# EAGLE design Chime PCB v2.8_11.17 (EAGLE 9.6.2)
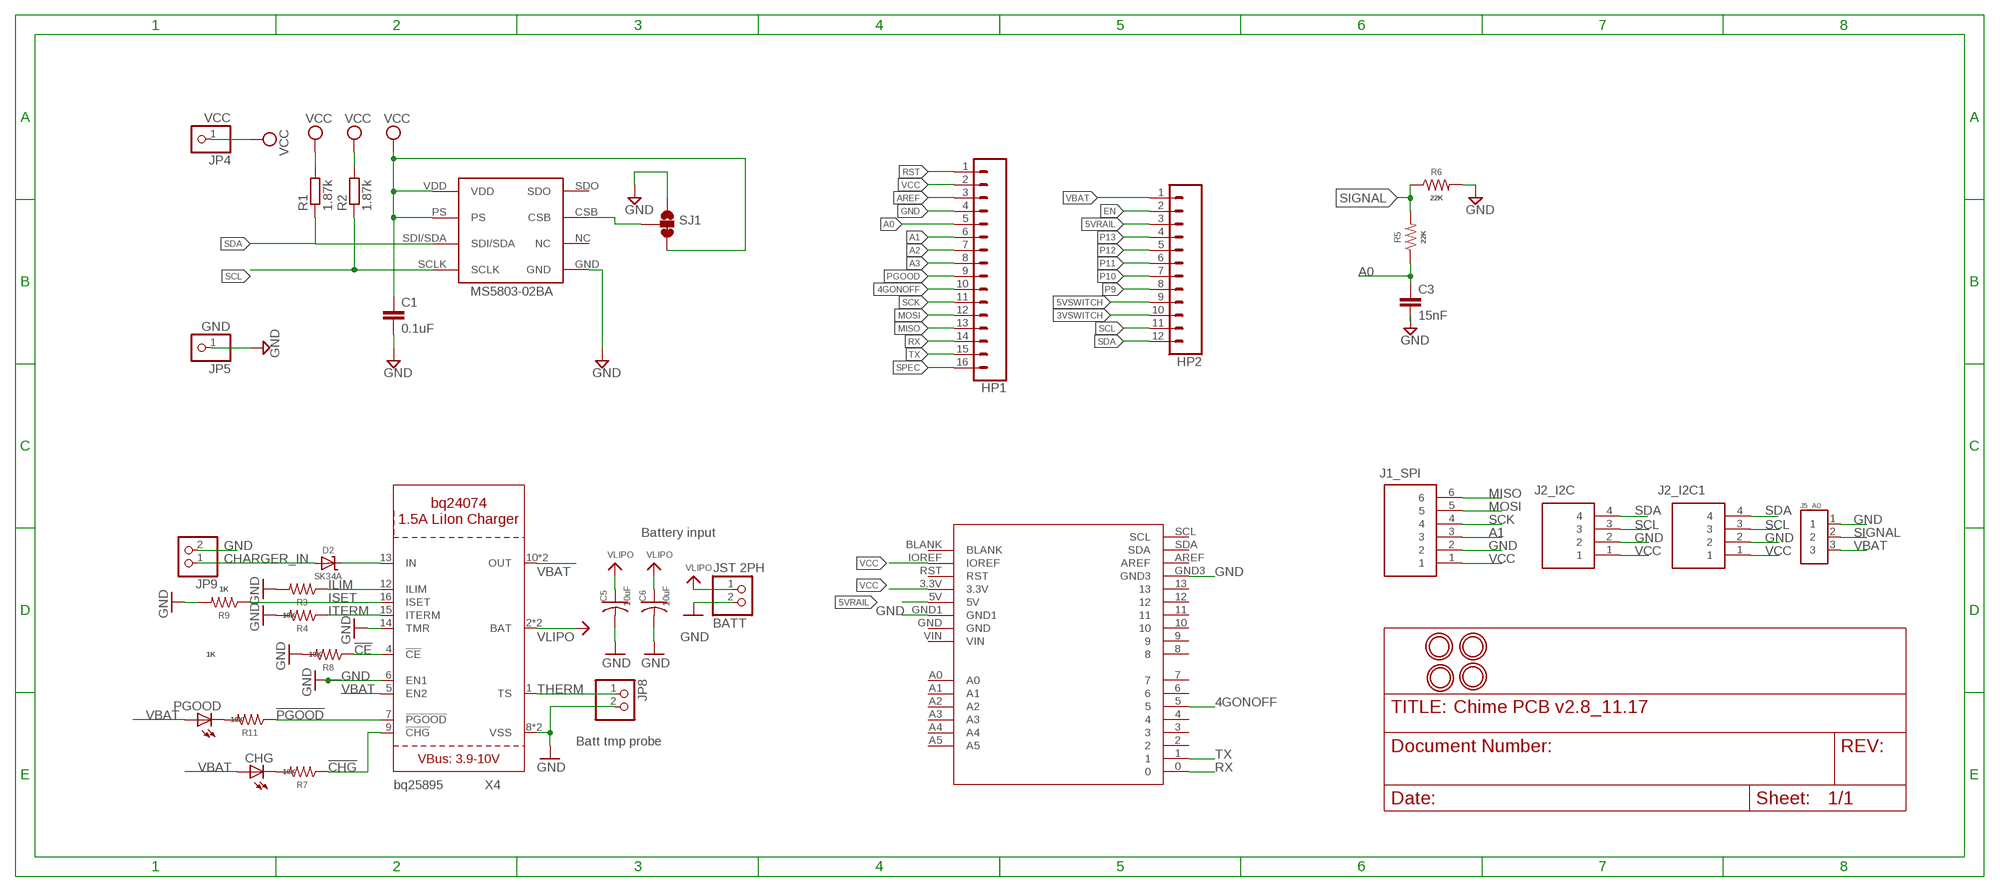
[diagram p0: schematic, sheet 1]

## Parts
BATT  JST 2PH  JST_2PIN-SMT-RA  [JST-PH-2-SMT-RA]
C1  0.1uF  C-EUC0805  [C0805]
C3  15nF  C-EUC0805  [C0805]
C5  10uF  C-USC0805K  [C0805K]
C6  10uF  C-USC0805K  [C0805K]
CHG  LEDCHIPLED_0805  [CHIPLED_0805]
D2  SK34A  DIODE-SCHOTTKYSMA  [SMADIODE]
HP1  CONN_16  [1X16]
HP2  CONN_12  [1X12]
J1_SPI  1725698  [1725698]
J2_I2C  1725672  [1725672]
J2_I2C1  1725672  [1725672]
J5_A0  282834-3  [TE_282834-3]
JP4  VCC  PINHD-1X1  [1X01]
JP5  GND  PINHD-1X1  [1X01]
JP8  PINHD-1X2  [1X02]
JP9  PINHD-1X2  [1X02]
PGOOD  PGOOD  LEDCHIPLED_0805  [CHIPLED_0805]
R1  1.87k  R-EU_R0805  [R0805]
R2  1.87k  R-EU_R0805  [R0805]
R3  1K  R-US_M0805  [M0805]
R4  10K  R-US_M0805  [M0805]
R5  22K  R-US_M0805  [M0805]
R6  22K  R-US_M0805  [M0805]
R7  10K  R-US_M0805  [M0805]
R8  10K  R-US_M0805  [M0805]
R9  1K  R-US_M0805  [M0805]
R11  10K  R-US_M0805  [M0805]
SJ1  JUMPER-SMT_3_1-NC_TRACE_SILK  [SMT-JUMPER_3_1-NC_TRACE_SILK]
U1  MS5803-02BA  [MS5803-02BA]
U$1  LTE_BOARD  [LTE_BOARD_FOOTPRINT]
U$2  MOUNTINGHOLE2.5  [MOUNTINGHOLE_2.5_PLATED]
U$3  MOUNTINGHOLE2.5  [MOUNTINGHOLE_2.5_PLATED]
U$4  MOUNTINGHOLE2.5  [MOUNTINGHOLE_2.5_PLATED]
U$5  MOUNTINGHOLE2.5  [MOUNTINGHOLE_2.5_PLATED]
X4  BQ24074  [QFN16_3MM]

## Nets
3VSWITCH: HP2.10
4GONOFF: HP1.10 U$1.5
5VRAIL: HP2.3 U$1.5V
5VSWITCH: HP2.9
!CE: R8.1 X4.4(!CE)
!CHG: R7.1 X4.9(!CHG)
!PGOOD: R11.1 X4.7(!PGOOD)
A0: C3.1 HP1.5 R5.1
A1: HP1.6 J1_SPI.3
A2: HP1.7
A3: HP1.8
AREF: HP1.3
CHARGER_IN: D2.A JP9.1
EN: HP2.2
GND: BATT.2 C1.2 C3.2 C5.2 C6.2 HP1.4 J1_SPI.2 J2_I2C1.2 J2_I2C.2 J5_A0.1 JP5.1 JP8.2 JP9.2 R3.2 R4.2 R6.2 R8.2 R9.2 SJ1.1 U1.GND U$1.GND1 U$1.GND3 X4.6(EN1) X4.8(VSS) X4.14(TMR) X4.THERMAL(VSS)
ILIM: R3.1 X4.12(ILIM)
ISET: R9.1 X4.16(ISET)
ITERM: R4.1 X4.15(ITERM)
MISO: HP1.13 J1_SPI.6
MOSI: HP1.12 J1_SPI.5
N$2: D2.C X4.13(IN)
N$3: SJ1.2 U1.CSB
N$4: PGOOD.C R11.2
N$5: CHG.C R7.2
P9: HP2.8
P10: HP2.7
P11: HP2.6
P12: HP2.5
P13: HP2.4
PGOOD: HP1.9
RST: HP1.1
RX: HP1.14 U$1.0
SCK: HP1.11 J1_SPI.4
SCL: HP2.11 J2_I2C1.3 J2_I2C.3 R2.1 U1.SCLK
SDA: HP2.12 J2_I2C1.4 J2_I2C.4 R1.1 U1.SDI/SDA
SIGNAL: J5_A0.2 R5.2 R6.1
SPEC: HP1.16
THERM: JP8.1 X4.1(TS)
TX: HP1.15 U$1.1
VBAT: CHG.A HP2.1 J5_A0.3 PGOOD.A X4.5(EN2) X4.10(OUT) X4.11(OUT)
VCC: C1.1 HP1.2 J1_SPI.1 J2_I2C1.1 J2_I2C.1 JP4.1 R1.2 R2.2 SJ1.3 U1.PS U1.VDD U$1.3.3V U$1.IOREF
VLIPO: BATT.1 C5.1 C6.1 X4.2(BAT) X4.3(BAT)
Unconnected: U1.NC U1.SDO U$1.2 U$1.3 U$1.4 U$1.6 U$1.7 U$1.8 U$1.9 U$1.10 U$1.11 U$1.12 U$1.13 U$1.A0 U$1.A1 U$1.A2 U$1.A3 U$1.A4 U$1.A5 U$1.AREF U$1.BLANK U$1.GND U$1.RST U$1.SCL U$1.SDA U$1.VIN

## Notes on the sheet
- Battery input
- Batt tmp probe

## Library data of the parts
BATT = adafruit:JST_2PIN: JST 2-Pin Connectors of various flavors SMT-RA (S2B-PH-SM4) 4UConnector #17311 SMT (B2B-PH-SM4) THM-RA (S2B-PH) THM (B2B-PH)
C1 C3 = rcl:C-EU: CAPACITOR, European symbol; SPICEPREFIX: C
C5 C6 = adafruit:C-US: CAPACITOR, American symbol
CHG PGOOD = adafruit:LED: LED OSRAM: - CHIPLED LG R971, LG N971, LY N971, LG Q971, LY Q971, LO R971, LY R971 LH N974, LH R974 LS Q976, LO Q976, LY Q976 LO Q996 - Hyper CHIPLED LW Q18S LB Q993, LB Q99A, LB R99A - SideLED LS A670, LO A670, LY A670, LG A670, LP A670 LB A673, LV A673, LT A673, LW A673 LH A674 LY A675 LS A676, LA A676, LO A676, LY A676, LW A676 LS A679, LY A679, LG A679 - Hyper Micro SIDELED® LS Y876, LA Y876, LO Y876, LY Y876 LT Y87S - SmartLED LW L88C, LW L88S LB L89C, LB L89S, LG L890 LS L89K, LO L89K, LY L89K LS L896, LA L896, LO L896, LY L896 - TOPLED LS T670, LO T670, LY T670, LG T670, LP T670 LSG T670, LSP T670, LSY T670, LOP T670, LYG T670 LG T671, LOG T671, LSG T671 LB T673, LV T673, LT T673, LW T673 LH T674 LS T676, LA T676, LO T676, LY T676, LB T676, LH T676, LSB T676, LW T676 LB T67C, LV T67C, LT T67C, LS T67K, LO T67K, LY T67K, LW E67C LS E67B, LA E67B, LO E67B, LY E67B, LB E67C, LV E67C, LT E67C LW T67C LS T679, LY T679, LG T679 LS T770, LO T770, LY T770, LG T770, LP T770 LB T773, LV T773, LT T773, LW T773 LH T774 LS E675, LA E675, LY E675, LS T675 LS T776, LA T776, LO T776, LY T776, LB T776 LHGB T686 LT T68C, LB T68C - Hyper Mini TOPLED® LB M676 - Mini TOPLED Santana® LG M470 LS M47K, LO M47K, LY M47K Source: http://www.osram.convergy.de/
D2 = microbuilder:DIODE-SCHOTTKY
HP1 = SparkFun-Connectors:CONN_16: Multi connection point. Often used as Generic Header-pin footprint for 0.1 inch spaced/style header connections On any of the 0.1 inch spaced packages, you can populate with these: Break Away Headers - Straight <https://www.sparkfun.com/products/116> (PRT-00116) Break Away Male Headers - Right Angle <https://www.sparkfun.com/products/553> (PRT-00553) Female Headers <https://www.sparkfun.com/products/115> (PRT-00115) Break Away Headers - Machine Pin <https://www.sparkfun.com/products/117> (PRT-00117) Break Away Female Headers - Swiss Machine Pin <https://www.sparkfun.com/products/743> (PRT-00743) For SCREWTERMINALS and SPRING TERMINALS visit here: Screw Terimnals on SparkFun.com <https://www.sparkfun.com/search/results?term=Screw+Terminals> (5mm/3.5mm/2.54mm spacing) This device is also useful as a general connection point to wire up your design to another part of your project. Our various solder wires solder well into these plated through hole pads. Hook-Up Wire - Assortment (Stranded, 22 AWG) <https://www.sparkfun.com/products/11375> (PRT-11375) Hook-Up Wire - Assortment (Solid Core, 22 AWG) <https://www.sparkfun.com/products/11367> (PRT-11367) View the entire wire category on our website here <https://www.sparkfun.com/categories/141> Special notes: Molex polarized connector foot print use with SKU : PRT-08231 with associated crimp pins and housings. 1MM SMD Version SKU: PRT-10208 NOTES ON THE VARIANTS LOCK and LOCK_LONGPADS... This footprint was designed to help hold the alignment of a through-hole component (i.e. 6-pin header) while soldering it into place. You may notice that each hole has been shifted either up or down by 0.005 of an inch from it's more standard position (which is a perfectly straight line). This slight alteration caused the pins (the squares in the middle) to touch the edges of the holes. Because they are alternating, it causes a "brace" to hold the component in place. 0.005 has proven to be the perfect amount of "off-center" position when using our standard breakaway headers. Although looks a little odd when you look at the bare footprint, once you have a header in there, the alteration is very hard to notice. Also,if you push a header all the way into place, it is covered up entirely on the bottom side.
HP2 = SparkFun-Connectors:CONN_12: Multi connection point. Often used as Generic Header-pin footprint for 0.1 inch spaced/style header connections On any of the 0.1 inch spaced packages, you can populate with these: Break Away Headers - Straight <https://www.sparkfun.com/products/116> (PRT-00116) Break Away Male Headers - Right Angle <https://www.sparkfun.com/products/553> (PRT-00553) Female Headers <https://www.sparkfun.com/products/115> (PRT-00115) Break Away Headers - Machine Pin <https://www.sparkfun.com/products/117> (PRT-00117) Break Away Female Headers - Swiss Machine Pin <https://www.sparkfun.com/products/743> (PRT-00743) For SCREWTERMINALS and SPRING TERMINALS visit here: Screw Terimnals on SparkFun.com <https://www.sparkfun.com/search/results?term=Screw+Terminals> (5mm/3.5mm/2.54mm spacing) This device is also useful as a general connection point to wire up your design to another part of your project. Our various solder wires solder well into these plated through hole pads. Hook-Up Wire - Assortment (Stranded, 22 AWG) <https://www.sparkfun.com/products/11375> (PRT-11375) Hook-Up Wire - Assortment (Solid Core, 22 AWG) <https://www.sparkfun.com/products/11367> (PRT-11367) View the entire wire category on our website here <https://www.sparkfun.com/categories/141> Special notes: Molex polarized connector foot print use with SKU : PRT-08231 with associated crimp pins and housings. 1MM SMD Version SKU: PRT-10208 NOTES ON THE VARIANTS LOCK and LOCK_LONGPADS... This footprint was designed to help hold the alignment of a through-hole component (i.e. 6-pin header) while soldering it into place. You may notice that each hole has been shifted either up or down by 0.005 of an inch from it's more standard position (which is a perfectly straight line). This slight alteration caused the pins (the squares in the middle) to touch the edges of the holes. Because they are alternating, it causes a "brace" to hold the component in place. 0.005 has proven to be the perfect amount of "off-center" position when using our standard breakaway headers. Although looks a little odd when you look at the bare footprint, once you have a header in there, the alteration is very hard to notice. Also,if you push a header all the way into place, it is covered up entirely on the bottom side.
J1_SPI = 1725698:1725698: Conn PC Terminal Block 6 POS 2.54mm Solder ST Thru-Hole 6A Source: Datasheet <https://www.phoenixcontact.com/online/portal/us/pxc/product_detail_page/!ut/p/z1/5Vddc6IwFP0r7oNvxYSPBHhEdNda6-KKW-GFISE6tHwVUmn76zeonY7dVmfH8WEH5s6QhHtv7jnJYeYCHyyBn4WbeB3yOM_CRMw9Hwdu3x0OHQXLP2eoD68HyB5OtF_yaKqA38AHfsUSRjmL7JCzdV6-AM-aTJoPPCTAk5tRQekD8B>; ARROW_PART_NUMBER: 1725698; ARROW_PRICE-STOCK: https://www.arrow.com/en/products/1725698/phoenix-contact?region=nac; DESCRIPTION: Conn PC Terminal Block 6 POS 2.54mm Solder ST Thru-Hole 6A; HEIGHT: 8.65mm; MANUFACTURER_NAME: Phoenix Contact; MANUFACTURER_PART_NUMBER: 1725698; MOUSER_PART_NUMBER: 651-1725698; MOUSER_PRICE-STOCK: https://www.mouser.co.uk/ProductDetail/Phoenix-Contact/1725698?qs=Ul7CXFMnlWUIR3VpVwwC4A%3D%3D
J2_I2C J2_I2C1 = 1725672:1725672: 4 way vertical PCB terminal,6A 63V Phoenix Contact Non-Fused Terminal Block, 4 Way, Solder Terminals, 26 ??? 20 AWG Through Hole, Nylon, 63 V Source: Datasheet <https://datasheet.datasheetarchive.com/originals/distributors/SFDatasheet-2/sf-00050602.pdf>; ARROW_PART_NUMBER: 1725672; ARROW_PRICE-STOCK: https://www.arrow.com/en/products/1725672/phoenix-contact?region=nac; DESCRIPTION: 4 way vertical PCB terminal,6A 63V Phoenix Contact Non-Fused Terminal Block, 4 Way, Solder Terminals, 26 ??? 20 AWG Through Hole, Nylon, 63 V; HEIGHT: 8.65mm; MANUFACTURER_NAME: Phoenix Contact; MANUFACTURER_PART_NUMBER: 1725672; MOUSER_PART_NUMBER: 651-1725672; MOUSER_PRICE-STOCK: https://www.mouser.co.uk/ProductDetail/Phoenix-Contact/1725672?qs=Ul7CXFMnlWXX93F9bOV2pQ%3D%3D
J5_A0 = Fixed Terminal Blocks 3P:282834-3: Conn; Term Blk; PCB; Wire Receptacle; 3; 2.54mm; 30-16AWG; Green; 10A; 150V; M1.6 Check availability <https://pricing.snapeda.com/parts/282834-3/TE%20Connectivity/view-part?ref=eda>; AVAILABILITY: In Stock; COMMENT: 282834-3; DESCRIPTION: 3 Position Wire to Board Terminal Block Horizontal with Board 0.100 (2.54mm); EU_ROHS_COMPLIANCE: Compliant with Exemptions; MF: TE Connectivity; MP: 282834-3; PACKAGE: None; PRICE: None; PURCHASE-URL: https://pricing.snapeda.com/search/part/282834-3/?ref=eda
JP4 JP5 = pinhead_simple:PINHD-1X1: PIN HEADER
JP8 JP9 = pinhead:PINHD-1X2: PIN HEADER
R1 R2 = rcl:R-EU_: RESISTOR, European symbol; SPICEPREFIX: R
R3-R9 R11 = adafruit:R-US_: RESISTOR, American symbol
SJ1 = SparkFun-Jumpers:JUMPER-SMT_3_1-NC_TRACE: Normally closed trace jumper (1 of 2 connections) This jumper has a trace between two pads so it's normally closed (NC). The other connection is normally open (NO). Use a razor knife to open the connection. For best results follow the IPC guidelines for cutting traces: Cutout at least 0.063 mm (0.005 in). Remove all loose material to clean up the cut area. Seal the cut with an approved epoxy. Reapply solder to reclose the connection, or to close the NO connection.
U1 = PNNL_Probe:MS5803-02BA
U$1 = LTE_BOARD_LOOM:LTE_BOARD: LTE_BOARD
U$2-U$5 = microbuilder:MOUNTINGHOLE: Mounting Hole For #2 screws (0.086"/2.18mm width, 0.094"/2.4mm hole) use 2.5mm; BOM: EXCLUDE
X4 = adafruit_power:BQ24074

## Board
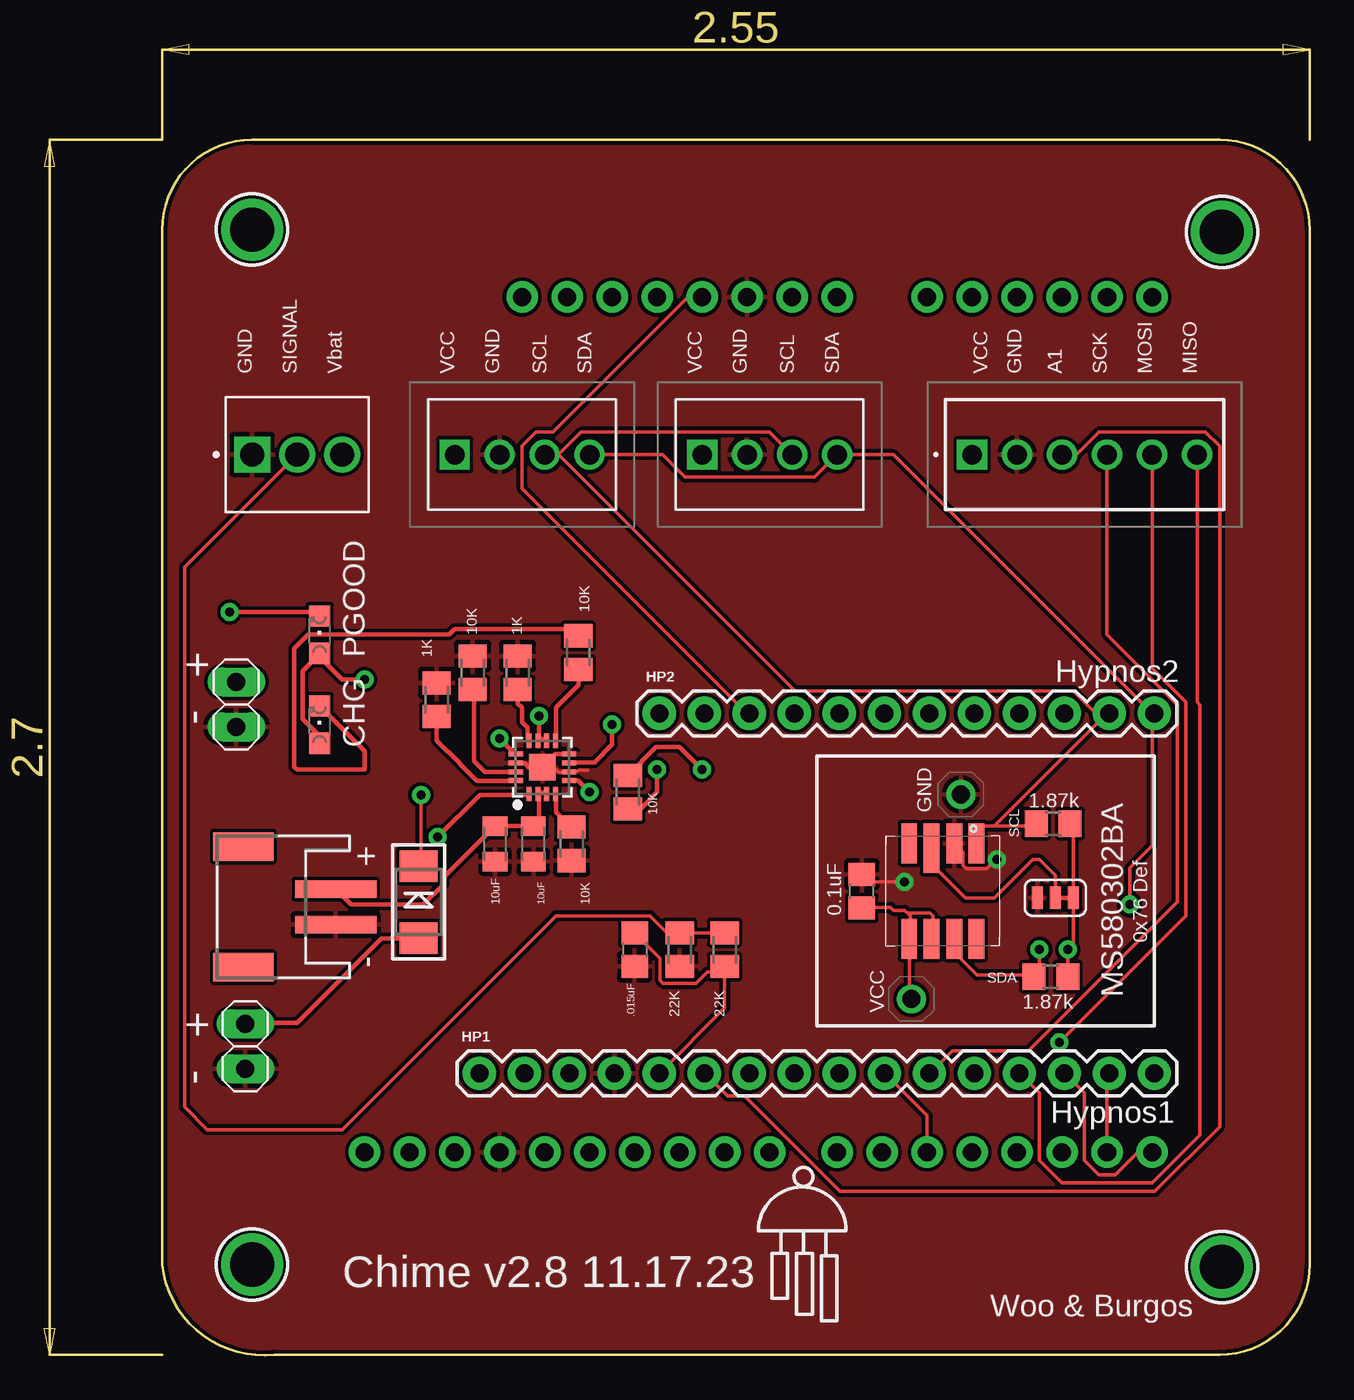
[diagram p1: board, top side]
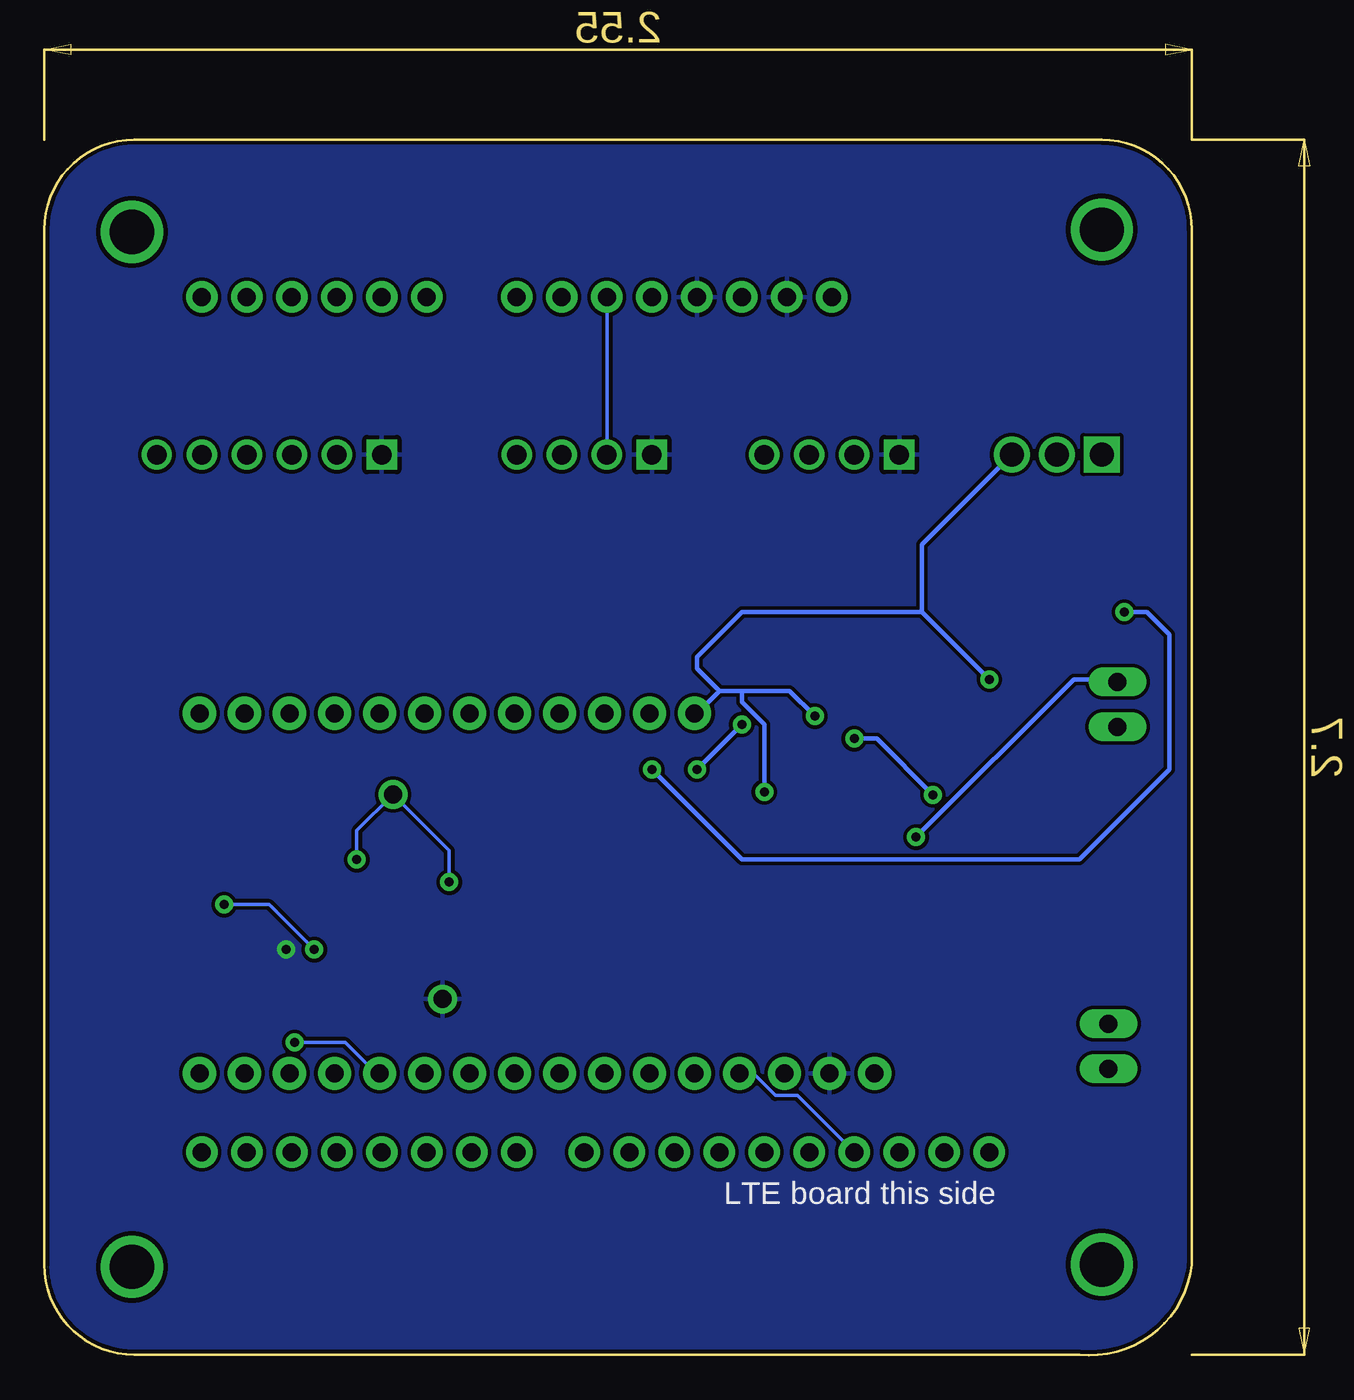
[diagram p2: board, bottom side, seen from below]

Size 64.77 x 68.61 mm. Coordinates in mm from the lower left corner, seen from the top.
Outline: 5.08,68.61 59.69,68.61 arc-90 64.77,63.53 64.77,5.11 arc-90 59.69,0.03 6.35,0.03 arc-90 0,5.11 0,63.53 arc-90 5.08,68.61
Copper layers (1*16): Top 0.035mm / dielectric 1.5mm / Bottom 0.035mm
Design rules "SparkFun": minimum track width 8mil, minimum drill 20mil, track to track 8mil, track to pad 8mil, pad to pad 8mil, via to via 8mil, smd to smd 8mil, copper to edge 8mil, drill to drill 8mil, minimum pad ring 12mil, minimum via ring 10mil, stop-mask expansion 4mil, vias tented up to drill 20mil, thermal gap 10mil

### Footprints (pad centres in the part's own frame; a part is rotated, then mirrored left to right if it is on the bottom)
JST-PH-2-SMT-RA = smd 1 x 4.6: 1 1,-3.7; 2 -1,-3.7 | smd 1.6 x 3.4: NC1 -3.4,1.5; NC2 3.4,1.5
C0805 = smd 1.3 x 1.5: 1 -0.95,0; 2 0.95,0
C0805K = smd 1.1 x 1.4: 1 -1,0; 2 1,0
CHIPLED_0805 = smd 1.2 x 1.2: A 0,-1.05; C 0,1.05
SMADIODE = smd 1.778 x 2.159: A 2.019,0; C -2.045,0
1X16 = drill 1.016 pad 1.88: 1 0,0; 2 2.54,0; 3 5.08,0; 4 7.62,0; 5 10.16,0; 6 12.7,0; 7 15.24,0; 8 17.78,0; 9 20.32,0; 10 22.86,0; 11 25.4,0; 12 27.94,0; 13 30.48,0; 14 33.02,0; 15 35.56,0; 16 38.1,0
1X12 = drill 1.016 pad 1.88: 1 0,0; 2 2.54,0; 3 5.08,0; 4 7.62,0; 5 10.16,0; 6 12.7,0; 7 15.24,0; 8 17.78,0; 9 20.32,0; 10 22.86,0; 11 25.4,0; 12 27.94,0
1725698 = drill 1.1 pad 1.65 square: 1 0,0 | drill 1.1 pad 1.65: 2 2.54,0; 3 5.08,0; 4 7.62,0; 5 10.16,0; 6 12.7,0
1725672 = drill 1.1 pad 1.65 square: 1 0,0 | drill 1.1 pad 1.65: 2 2.54,0; 3 5.08,0; 4 7.62,0
TE_282834-3 = drill 1.36 square: 1 0,0 | drill 1.36: 2 2.54,0; 3 5.08,0
1X01 = drill 1.016: 1 0,0
1X02 = drill 1.016 long: 1 -1.27,0; 2 1.27,0
R0805 = smd 1.3 x 1.5: 1 -0.95,0; 2 0.95,0
M0805 = smd 1.3 x 1.6: 1 -0.95,0; 2 0.95,0
SMT-JUMPER_3_1-NC_TRACE_SILK = smd 0.635 x 1.27: 1 -1.016,0; 2 0,0; 3 1.016,0
MS5803-02BA = smd 2.8 x 0.9: CSB 2.42,0.65 | smd 2.25 x 0.9: GND 2.7,-0.65; NC 2.7,1.9; PS -2.7,0.65; SCLK 2.7,-1.9; SDI/SDA -2.7,-0.65; SDO -2.7,-1.9; VDD -2.7,1.9
LTE_BOARD_FOOTPRINT = drill 1.016 pad 1.778: 0 35.56,48.26; 1 33.02,48.26; 2 30.48,48.26; 3 27.94,48.26; 3.3V 7.62,0; 4 25.4,48.26; 5 22.86,48.26; 5V 10.16,0; 6 20.32,48.26; 7 17.78,48.26; 8 13.97,48.26; 9 11.43,48.26; 10 8.89,48.26; 11 6.35,48.26; 12 3.81,48.26; 13 1.27,48.26; A0 22.86,0; A1 25.4,0; A2 27.94,0; A3 30.48,0; A4 33.02,0; A5 35.56,0; AREF -3.81,48.26; BLANK 0,0; GND 15.24,0; GND1 12.7,0; GND3 -1.27,48.26; IOREF 2.54,0; RST 5.08,0; SCL -8.89,48.26; SDA -6.35,48.26; VIN 17.78,0
MOUNTINGHOLE_2.5_PLATED = drill 2.5 pad 3.2: P$1 0,0
QFN16_3MM = smd 0.8 x 0.28: 1 -1.5,0.75; 2 -1.5,0.25; 3 -1.5,-0.25; 4 -1.5,-0.75; 9 1.5,-0.75; 10 1.5,-0.25; 11 1.5,0.25; 12 1.5,0.75 | smd 0.28 x 0.8: 5 -0.75,-1.5; 6 -0.25,-1.5; 7 0.25,-1.5; 8 0.75,-1.5; 13 0.75,1.5; 14 0.25,1.5; 15 -0.25,1.5; 16 -0.75,1.5 | smd 1.5 x 1.5: THERMAL 0,0

### Placement (x,y rotation side)
BATT  6.1,25.31 90 top
C1  39.5,26.2 90 top
C3  26.67,22.89 270 top
C5  20.95,28.86 270 top
C6  18.8,28.86 270 top
CHG  8.89,35.59 0 top
D2  14.48,25.56 270 top
HP1  17.91,15.91 0 top
HP2  28.07,36.23 0 top
J1_SPI  45.72,50.83 0 top
J2_I2C  30.48,50.83 0 top
J2_I2C1  16.51,50.83 0 top
J5_A0  5.08,50.83 0 top
JP4  42.29,20.1 90 top
JP5  45.09,31.66 90 top
JP8  4.19,36.74 270 top
JP9  4.7,17.43 270 top
PGOOD  8.89,40.67 0 top
R1  50.17,21.37 0 top
R2  50.29,30.01 0 top
R3  20.07,38.52 90 top
R4  17.53,38.52 90 top
R5  31.75,22.89 90 top
R6  29.21,22.89 270 top
R7  23.5,39.66 90 top
R8  23.11,28.86 270 top
R9  15.49,36.99 90 top
R11  26.29,31.78 90 top
SJ1  50.42,25.82 0 top
U1  44.07,26.2 90 top
U$1  20.32,59.72 180 bottom
U$2  5.08,5.11 0 top
U$3  5.08,63.53 0 top
U$4  59.82,63.41 0 top
U$5  59.82,4.99 0 top
X4  21.46,33.18 90 top

### Tracks (layer width: path | path; a pad name or v marks a point on that pad's centre or on a via)
4GONOFF
  Top 0.203: U$1.5 43.18,13.53 40.8,15.91 HP1.10
5VRAIL
  Top 0.203: U$1.5V 29.69,59.72 22.07,52.1 21.11,52.1 20.32,51.31 20.32,48.93 33.02,36.23 HP2.3
!CE
  Top 0.203: 22.22,31.63 X4.4 | 23.02,29.88 R8.1
  Top 0.254: 22.22,31.63 22.22,30.67 23.02,29.88
!CHG
  Top 0.203: 22.22,34.8 X4.9
  Top 0.254: 22.22,34.8 22.22,36.55 23.5,37.82 R7.1
!PGOOD  (via drill 0.51)
  Top 0.254: X4.7 23.32,33.43 23.35,33.46 24.4,33.46 25.4,34.46 v25.4,35.59 | R11.1 26.99,30.83 27.94,31.78 v27.94,33.05
  Bottom 0.254: v27.94,33.05 v25.4,35.59
A0
  Top 0.203: R5.1 31.75,21.62 | 31.75,21.62 31.75,19.59 HP1.5 | 31.75,21.62 30.77,21.62 30.14,20.99 28.28,20.99 28.11,21.17 28.11,22.41 C3.1
A1
  Top 0.203: J1_SPI.3 51.59,50.83 52.86,52.1 58.9,52.1 59.69,51.31 59.69,12.89 56.04,9.24 38.26,9.24 32.86,14.64 31.91,14.64 30.64,15.91 HP1.6
CHARGER_IN
  Top 0.203: 14.45,23.53 D2.A | 4.76,18.77 JP9.1
  Top 0.254: 14.45,23.53 12.38,23.53 7.62,18.77 4.76,18.77
GND  (via drill 0.51)
  Top 0.203: X4.THERMAL 21.59,33.05 22.22,33.05 22.38,32.9 22.86,32.9 X4.6 23.02,32.99 23.49,32.99 23.53,33.03 24,33.03 | v41.91,26.7 39.94,26.7 C1.2 | U1.GND 45.21,28.4 45.21,27.65 45.39,27.47 46.55,27.47 47.05,27.97 v47.13,27.97
  Top 0.254: X4.14 19.99,33.4 20.5,33.4 20.72,33.18 X4.THERMAL 22.21,33.93 X4.8
  Bottom 0.203: U$1.GND3 22.25,14.66 23.5,14.66 24.75,15.91 HP1.4 | U$1.GND1 J2_I2C.2 | v41.91,26.7 41.91,28.48 JP5.1 47.13,29.61 v47.13,27.97
  pour Top: 0,68.61 64.77,68.61 64.77,0.03 0,0.03
ILIM
  Top 0.254: X4.12 20.64,34.8 20.64,35.44 20.32,35.75 20.32,36.55 20.07,36.79 R3.1
ISET
  Top 0.203: 19.84,32.42 X4.16
  Top 0.254: 19.84,32.42 17.78,32.42 16.83,33.37 16.78,33.42 15.49,34.71 R9.1
ITERM
  Top 0.203: 17.62,37.5 R4.1
  Top 0.254: 17.62,37.5 17.62,33.53 18.22,32.93 X4.15
MISO
  Top 0.203: J1_SPI.6 58.42,36.86 58.58,36.71 58.58,12.42 55.88,9.72 50.8,9.72 49.53,10.99 49.53,14.8 48.42,15.91 HP1.13
MOSI  (via drill 0.51)
  Top 0.203: J1_SPI.5 55.88,38.77 57.79,36.86 57.79,24.8 v50.64,17.66
  Bottom 0.203: v50.64,17.66 47.78,17.66 46.04,15.91 HP1.12
N$2  (via drill 0.51)
  Top 0.203: v14.61,31.63 14.61,27.66 D2.C | 19.84,34.01 X4.13
  Top 0.254: v19.05,34.8 19.84,34.01
  Bottom 0.254: v14.61,31.63 17.78,34.8 v19.05,34.8
N$3
  Top 0.203: U1.CSB 43.42,27.74 45.34,25.82 46.99,25.82 49.15,27.97 49.53,27.97 50.42,27.09 SJ1.2
N$4  (via drill 0.51)
  Top 0.254: R11.2 27.88,34.32 29.21,34.32 v30.48,33.05 | v3.81,41.94 8.67,41.94 PGOOD.C
  Bottom 0.254: v30.48,33.05 25.4,27.97 6.35,27.97 1.27,33.05 1.27,40.67 2.54,41.94 v3.81,41.94
N$5
  Top 0.203: 23.18,40.99 23.5,40.67 R7.2
  Top 0.254: 23.18,40.99 16.51,40.99 16.19,40.67 8.26,40.67 7.46,39.88 7.46,33.21 7.62,33.05 11.43,33.05 11.43,34.1 CHG.C
RX
  Top 0.203: U$1.0 55.09,11.46 53.82,10.19 52.86,10.19 52.07,10.99 52.07,14.8 50.96,15.91 HP1.14
SCK
  Top 0.203: J1_SPI.4 53.34,40.67 57.31,36.71 57.31,25.59 48.9,17.18 44.61,17.18 43.34,15.91 HP1.11
SCL
  Top 0.203: 22.38,50.83 23.65,52.1 34.29,52.1 J2_I2C.3 | 45.88,29.88 45.88,28.93 U1.SCLK 45.88,29.88 | 45.88,29.88 46.99,29.88 | 46.99,29.88 49.21,29.88 R2.1 | 46.99,29.88 53.02,35.91 | 53.02,35.91 53.34,36.23 HP2.11 53.02,35.91 | 22.38,50.83 35.72,37.5 51.44,37.5 53.02,35.91 | 22.38,50.83 J2_I2C1.3
SDA  (via drill 0.51)
  Top 0.203: J2_I2C1.4 28.26,50.83 29.53,49.56 36.83,49.56 J2_I2C.4 41.28,50.83 55.88,36.23 | 55.88,36.23 55.88,28.77 54.61,27.5 v54.61,25.43 | 55.88,36.23 HP2.12 | v49.53,22.89 49.53,21.69 R1.1 49.21,21.47 45.99,21.47 44.72,22.74 44.72,22.89 U1.SDI/SDA
  Bottom 0.203: v49.53,22.89 52.07,25.43 v54.61,25.43
SIGNAL
  Top 0.203: R5.2 R6.1 28.5,23.84 27.55,24.8 22.22,24.8 10.16,12.73 2.54,12.73 1.27,14 1.27,44.48 J5_A0.2
THERM  (via drill 0.51)
  Top 0.203: 20.64,31.63 X4.1
  Top 0.254: 20.64,31.63 17.94,31.63 v15.56,29.24
  Bottom 0.203: 4.29,38.13 JP8.1
  Bottom 0.254: v15.56,29.24 6.67,38.13 4.29,38.13
TX
  Top 0.203: U$1.1 53.34,15.91 HP1.15
VBAT  (via drill 0.51)
  Top 0.203: 8.89,34.96 CHG.A | 8.81,39.48 8.89,39.56 PGOOD.A | X4.10 21.59,34.8 21.27,34.8 X4.11
  Top 0.254: 8.89,34.96 7.94,35.91 7.94,38.61 8.81,39.48 10.16,38.13 v11.43,38.13 | v21.27,36.07 21.27,34.8 | X4.5 23.48,32.43 v24.13,31.78
  Bottom 0.203: 27.94,36.23 HP2.1
  Bottom 0.254: 25.4,37.5 22.7,37.5 v21.27,36.07 | 25.4,37.5 26.67,37.5 | v11.43,38.13 15.24,41.94 | 15.24,41.94 25.4,41.94 27.94,39.4 27.94,38.77 26.67,37.5 | 26.67,37.5 27.94,36.23 | v24.13,31.78 24.13,35.59 25.4,36.86 25.4,37.5 | 15.24,41.94 15.24,45.75 J5_A0.3
VCC  (via drill 0.51)
  Top 0.203: R1.2 51.12,21.47 v51.12,22.89 51.44,23.21 SJ1.3 51.44,29.72 51.28,29.88 R2.2 | 42.07,24.96 41.91,25.12 41.28,25.12 41.12,25.28 39.53,25.28 C1.1 | 42.07,24.96 42.23,24.8 42.23,23.53 U1.VDD 42.17,20.22 JP4.1 | 42.07,24.96 43.34,24.96 43.5,24.8 43.5,23.53 U1.PS
  pour Bottom: 0,68.61 64.77,68.61 64.77,0.03 0,0.03
VLIPO
  Top 0.203: X4.3 21.59,31.78 21.27,31.78 X4.2 21.27,31.63 | 21.27,30.2 20.95,29.88 C5.1 | 18.89,29.88 C6.1
  Top 0.254: 21.27,30.2 21.27,31.63 | 20.95,29.88 18.89,29.88 | BATT.1 10.67,25.43 14.74,25.43 15.89,26.58 15.89,26.96 C6.1

### Text on the board
tPlace: GND | SIGNAL | Vbat | VCC | GND | SCL | SDA | VCC | GND | SCL | SDA | VCC | GND | A1 | SCK | MOSI | MISO | 10K | 10K | 1K | 1K | Hypnos2 | 1.87k | 10K | GND | SCL | 10uF | 10uF | 10K | 0.1uF | 0x76 Def | SDA | 1.87k | MS580302BA | .015uF | 22K | 22K | VCC | Hypnos1 | Chime v2.8 11.17.23 | Woo & Burgos
tNames: + | - | + | -
bNames: LTE board this side